# EAGLE design mrf49xa-small-v2 (EAGLE 5.11)
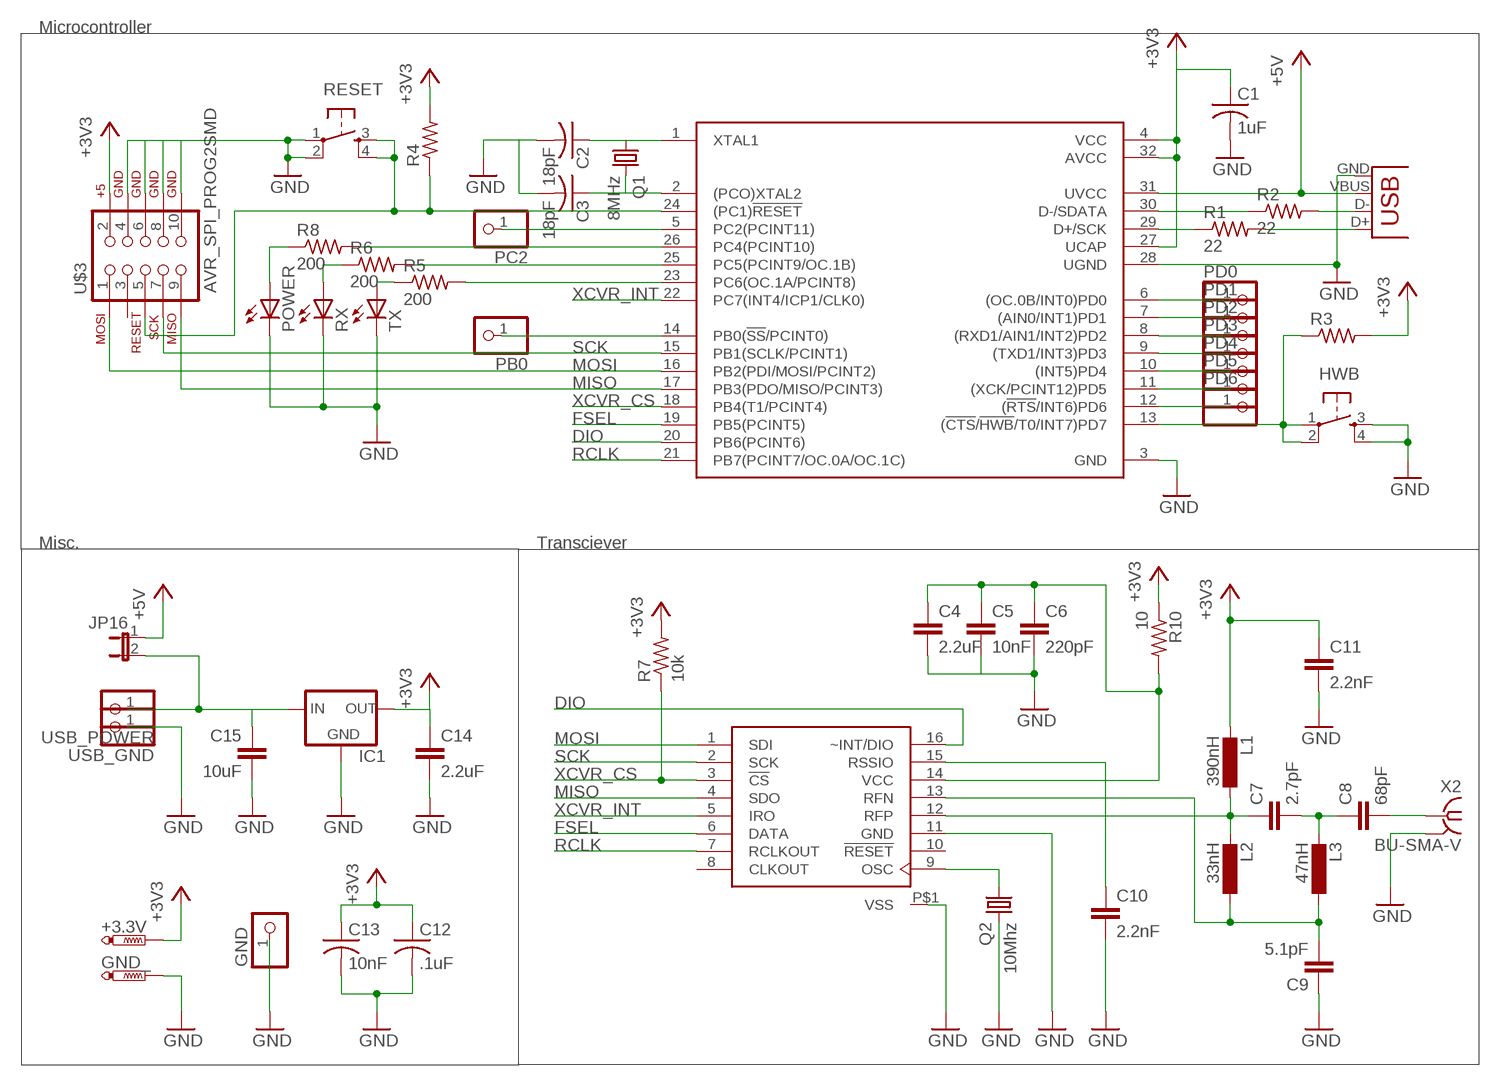
[diagram p0: schematic, sheet 1]

## Parts
+3.3V  PTR1PAD1-13  [P1-13]
C1  1uF  C-USC0603  [C0603]
C2  18pF  C-USC0603  [C0603]
C3  18pF  C-USC0603  [C0603]
C4  2.2uF  C-EUC3216  [C3216]
C5  10nF  C-EUC0603  [C0603]
C6  220pF  C-EUC0603  [C0603]
C7  2.7pF  C-EUC0603  [C0603]
C8  68pF  C-EUC0603  [C0603]
C9  5.1pF  C-EUC0603  [C0603]
C10  2.2nF  C-EUC0603  [C0603]
C11  2.2nF  C-EUC0603  [C0603]
C12  .1uF  C-USC0603  [C0603]
C13  10nF  C-USC0805  [C0805]
C14  2.2uF  C-EUC3216  [C3216]
C15  10uF  C-EUC3216  [C3216]
GND  PINHD-1X1  [1X01]
GND_  PTR1PAD1-13  [P1-13]
HWB  TAC_SWITCHSMD  [TACTILE_SWITCH_SMD]
IC1  78MXXLSOT-89  [SOT89-BCE]
JP16  JUMPER-2PTH  [1X02]
L1  390nH  L-EU0603  [R0603]
L2  33nH  L-EU0603  [R0603]
L3  47nH  L-EU0603  [R0603]
PB0  PINHD-1X1  [1X01]
PC2  PINHD-1X1  [1X01]
PD0  PINHD-1X1  [1X01]
PD1  PINHD-1X1  [1X01]
PD2  PINHD-1X1  [1X01]
PD3  PINHD-1X1  [1X01]
PD4  PINHD-1X1  [1X01]
PD5  PINHD-1X1  [1X01]
PD6  PINHD-1X1  [1X01]
POWER  LED1206  [LED-1206]
Q1  8MHz  CRYSTALCTS406  [CTS406]
Q2  10Mhz  CRYSTALCTS406  [CTS406]
R1  22  R-US_R0603  [R0603]
R2  22  R-US_R0603  [R0603]
R3  R-US_R0603  [R0603]
R4  R-US_R0603  [R0603]
R5  200  R-US_R0603  [R0603]
R6  200  R-US_R0603  [R0603]
R7  10k  R-US_R0603  [R0603]
R8  200  R-US_R0603  [R0603]
R10  10  R-US_R0603  [R0603]
RESET  TAC_SWITCHSMD  [TACTILE_SWITCH_SMD]
RX  LED1206  [LED-1206]
TX  LED1206  [LED-1206]
U$1  AT90USB2  [TQFP32-08]
U$2  MRF49XA  [TSSOP16]
U$3  AVR_SPI_PROG2SMD  [2X5-SHROUDED_SMD]
USB_GND  PINHD-1X1  [1X01]
USB_POWER  PINHD-1X1  [1X01]
X1  USBSMD  [USB-MINIB]
X2  BU-SMA-V  [BU-SMA-V]

## Nets
5V: C15.1 IC1.E(IN) JP16.2 USB_POWER.1
+3V3: +3.3V.TP C1.1 C11.1 C12.1 C13.1 C14.1 IC1.B(OUT) L1.2 R3.2 R4.2 R7.2 R10.1 U$1.4(VCC) U$1.27(UCAP) U$1.32(AVCC) U$3.2
+5V: JP16.1 U$1.31(UVCC) X1.VBUS
AMPCTRL: R6.2 U$1.25(PC5(PCINT9/OC.1B))
DIO: U$1.20(PB6(PCINT6)) U$2.16(~INT/DIO)
FSEL: U$1.19(PB5(PCINT5)) U$2.6(DATA)
GND: C1.2 C2.2 C3.2 C4.2 C5.2 C6.2 C9.1 C10.2 C11.2 C12.2 C13.2 C14.2 C15.2 GND.1 GND_.TP HWB.3 HWB.4 IC1.C(GND) POWER.C Q2.3 RESET.1 RESET.2 RX.C TX.C U$1.3(GND) U$1.28(UGND) U$2.11(GND) U$2.P$1(VSS) U$3.4 U$3.6 U$3.8 U$3.10 USB_GND.1 X1.GND X2.2(GND)
MISO: U$1.17(PB3(PDO/MISO/PCINT3)) U$2.4(SDO) U$3.9
MOSI: U$1.16(PB2(PDI/MOSI/PCINT2)) U$2.1(SDI) U$3.1
N$1: C8.2 X2.1
N$2: R1.1 U$1.29(D+/SCK)
N$3: R2.1 U$1.30(D-/SDATA)
N$4: R1.2 X1.D+
N$5: R2.2 X1.D-
N$6: R4.1 RESET.3 RESET.4 U$1.24((PC1)!RESET) U$3.5
N$7: C2.1 Q1.1 U$1.1(XTAL1)
N$8: C3.1 Q1.3 U$1.2((PCO)XTAL2)
N$9: PD3.1 U$1.9((TXD1/INT3)PD3)
N$10: R8.2 U$1.26(PC4(PCINT10))
N$11: R5.1 TX.A
N$12: R6.1 RX.A
N$13: POWER.A R8.1
N$14: PD2.1 U$1.8((RXD1/AIN1/INT2)PD2)
N$15: PB0.1 U$1.14(PB0(!SS!/PCINT0))
N$16: PD0.1 U$1.6((OC.0B/INT0)PD0)
N$17: HWB.1 HWB.2 R3.1 U$1.13((!CTS!/!HWB!/T0/INT7)PD7)
N$18: PD1.1 U$1.7((AIN0/INT1)PD1)
N$19: PD4.1 U$1.10((INT5)PD4)
N$20: Q2.1 U$2.9(OSC)
N$21: C9.2 L2.1 L3.1 U$2.13(RFN)
N$22: C7.1 L1.1 L2.2 U$2.12(RFP)
N$23: C7.2 C8.1 L3.2
N$25: C4.1 C5.1 C6.1 R10.2 U$2.14(VCC)
N$26: PD5.1 U$1.11((XCK/PCINT12)PD5)
N$27: PD6.1 U$1.12((!RTS!/INT6)PD6)
PC2: PC2.1 U$1.5(PC2(PCINT11))
RCLK: U$1.21(PB7(PCINT7/OC.0A/OC.1C)) U$2.7(RCLKOUT)
RSSIO: C10.1 U$2.15(RSSIO)
SCK: U$1.15(PB1(SCLK/PCINT1)) U$2.2(SCK) U$3.7
SWITCH1: R5.2 U$1.23(PC6(OC.1A/PCINT8))
XCVR_CS: R7.1 U$1.18(PB4(T1/PCINT4)) U$2.3(!CS)
XCVR_INT: U$1.22(PC7(INT4/ICP1/CLK0)) U$2.5(IRO)
Unconnected: U$2.8(CLKOUT) U$2.10(!RESET) U$3.3

## Notes on the sheet
- Microcontroller
- Misc. | Transciever

## Power pins joined to a net without a drawn wire
GND: X2.3(GND) X2.4(GND) X2.5(GND)

## Library data of the parts
+3.3V GND_ = testpad:PTR1: TEST PIN
C1-C3 C12 C13 = rcl:C-US: CAPACITOR, American symbol
C4-C11 C14 C15 = rcl:C-EU: CAPACITOR, European symbol
GND PB0 PC2 PD0 PD1-PD6 USB_GND USB_POWER = pinhead:PINHD-1X1: PIN HEADER
HWB RESET = SparkFun:TAC_SWITCH: Momentary Switch Button commonly used for reset or general input. Spark Fun Electronics SKU : COM-00097
IC1 = SLIM:78MXXL: VOLTAGE REGULATOR
JP16 = SparkFun:JUMPER-2: Jumper Basic 0.1" spaced jumper. Use with breakaway headers.
L1-L3 = rcl:L-EU: INDUCTOR, European symbol
POWER RX TX = SparkFun:LED: LEDs Standard schematic elements and footprints for 5mm, 3mm, 1206, and 0603 sized LEDs. 5mm - Spark Fun Electronics SKU : COM-00529 (and others)
Q1 Q2 = crystal:CRYSTAL: CRYSTAL
R1-R8 R10 = rcl:R-US_: RESISTOR, American symbol
U$1 = Atmel:AT90USB*2
U$2 = microchip:MRF49XA
U$3 = SparkFun:AVR_SPI_PROG2: AVR ICSP Header This is the standard AVR In Circuit Serial Programming header. Minimal, but includes pin one indicator. Works with standard Olimex programmers. Also look for the 6-pin reduced version. Spark Fun Electronics SKU: PRT-00778
X1 = SparkFun:USB: USB Connectors USB-B-PTH is fully proven SKU : PRT-00139 USB-miniB is fully proven SKU : PRT-00587 USB-A-PCB is untested. USB-A-H is throughly reviewed, but untested. Spark Fun Electronics SKU : PRT-00437 USB-B-SMT is throughly reviewed, but untested. Needs silkscreen touching up. USB-A-S has not been used/tested USB-MB-H has not been used/tested
X2 = con-coax:BU-SMA-V: FEMALE SMA CONNECTOR Radiall distributor RS 112-3794; OC_FARNELL: unknown; OC_NEWARK: unknown

## Board
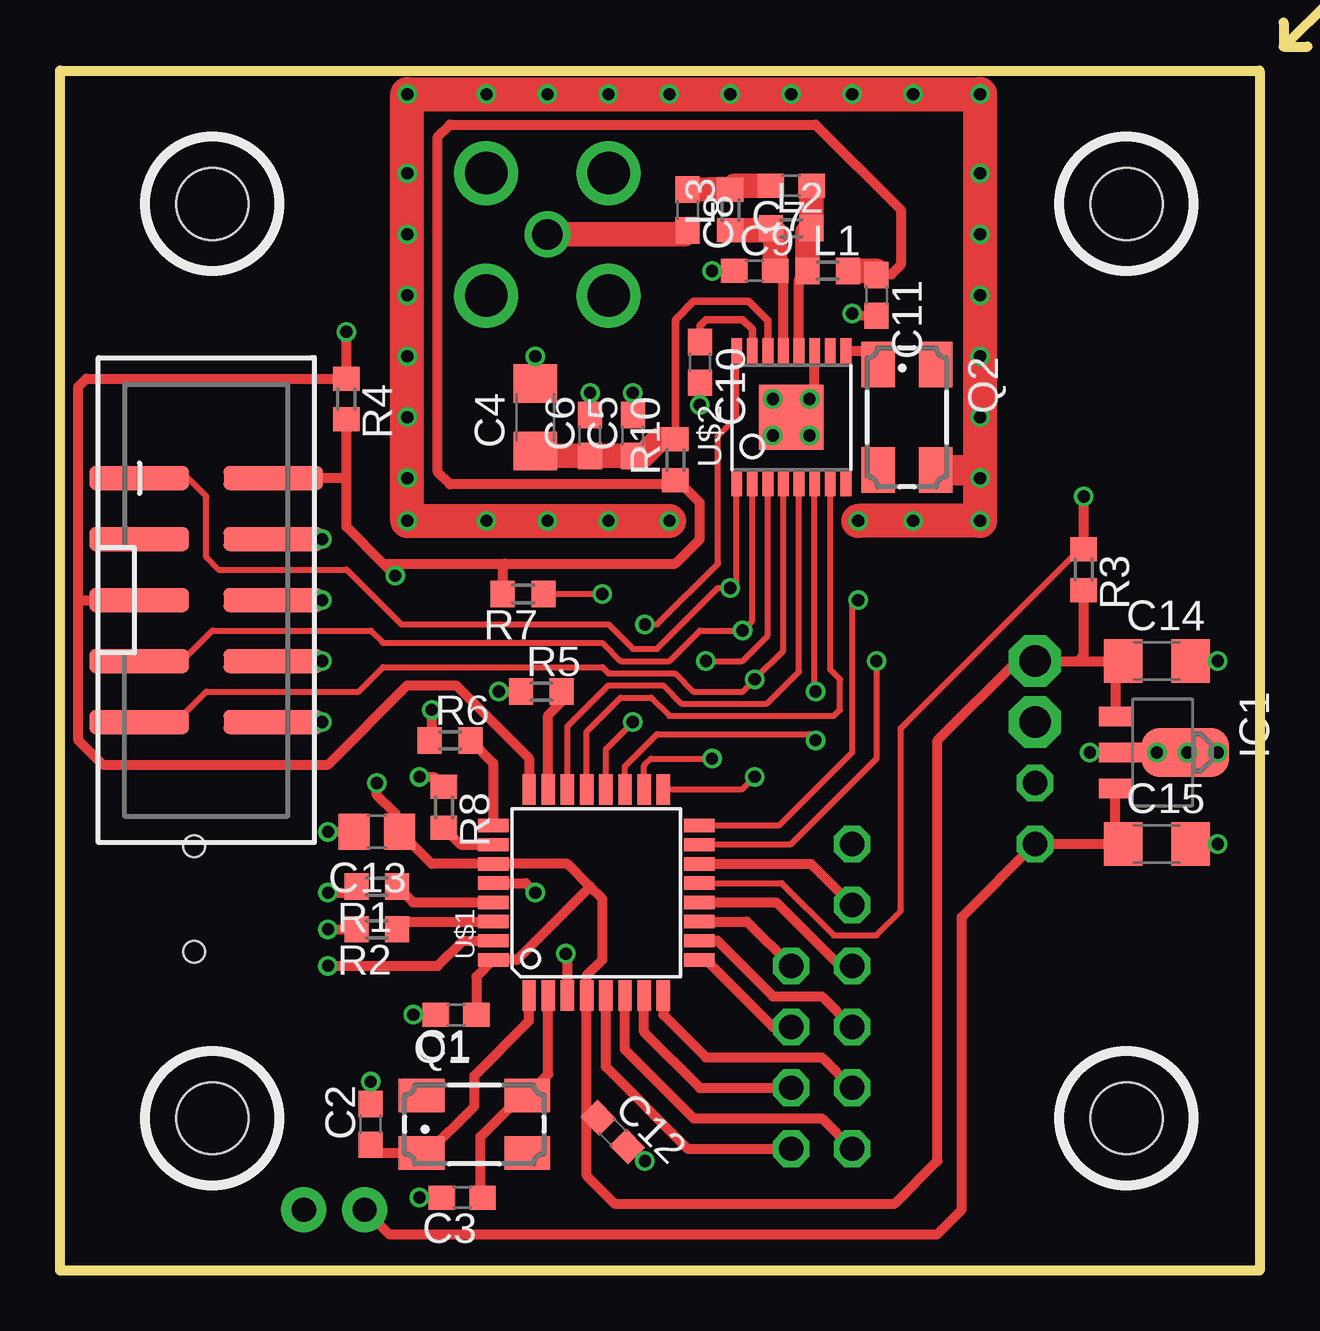
[diagram p1: board, top side]
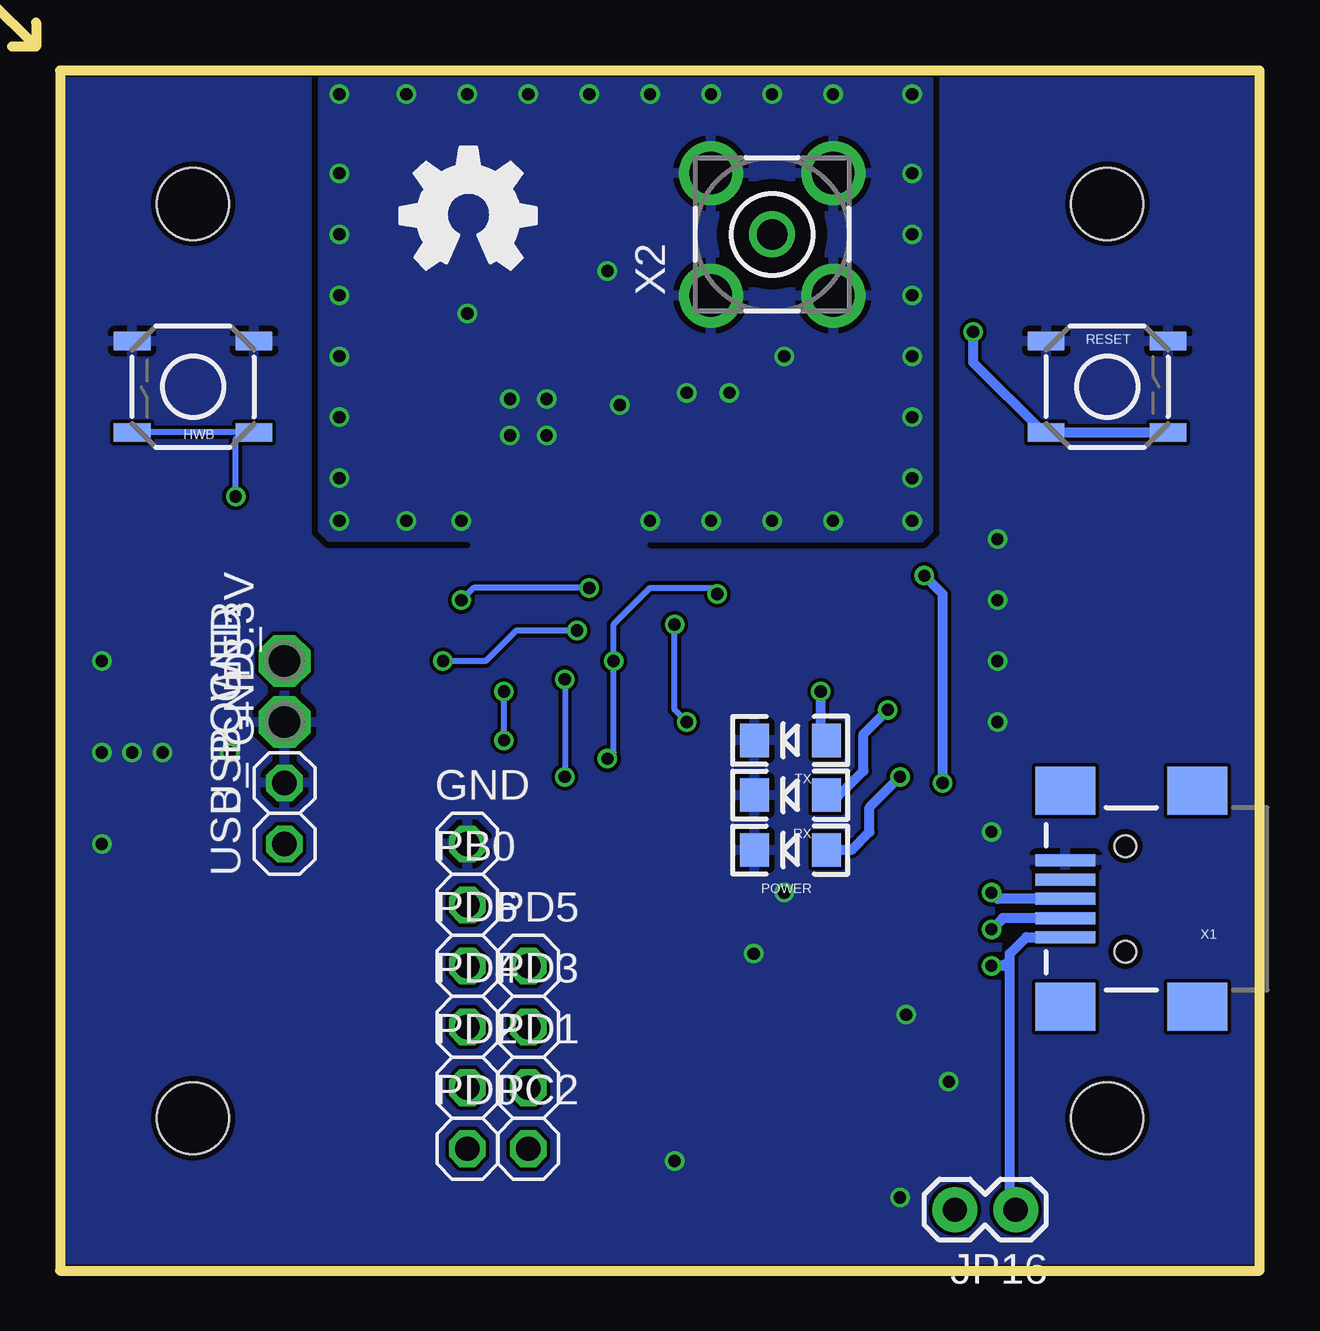
[diagram p2: board, bottom side, seen from below]

Size 50 x 50 mm. Coordinates in mm from the lower left corner, seen from the top.
Outline: 0,0 50,0 50,50 0,50 0,0
Copper layers (1*16): Top 0.035mm / dielectric 1.5mm / Bottom 0.035mm
Design rules "ITead_rule": minimum track width 6mil, minimum drill 12mil, track to track 6mil, track to pad 6mil, pad to pad 6mil, via to via 6mil, smd to smd 0mil, copper to edge 10mil, drill to drill 10mil, minimum pad ring 10mil, minimum via ring 6mil, stop-mask expansion 2mil, vias tented up to drill 100mil, thermal gap 10mil
Holes 3 mm at 6.35,44.45 44.45,44.45 44.45,6.35 6.35,6.35
bRestrict: area 18.5,41.4 to 22.1,45; 6 lines
Milling: 7 lines

### Footprints (pad centres in the part's own frame; a part is rotated, then mirrored left to right if it is on the bottom)
P1-13 = drill 1.321 pad 2.159 octagon: TP 0,0
C0603 = smd 1.1 x 1: 1 -0.85,0; 2 0.85,0
C3216 = smd 1.6 x 1.8: 1 -1.4,0; 2 1.4,0
C0805 = smd 1.3 x 1.5: 1 -0.95,0; 2 0.95,0
1X01 = drill 1.016 octagon: 1 0,0
TACTILE_SWITCH_SMD = smd 1.524 x 0.762: 1 -2.54,1.905; 2 2.54,1.905; 3 -2.54,-1.905; 4 2.54,-1.905
SOT89-BCE = smd 0.8 x 1.4: B -1.499,-1.981; E 1.499,-1.981 | smd 0.8 x 1.9: C 0,-1.727 | smd 2.032 x 3.65: C@1 0,0.94
1X02 = drill 1.016 pad 1.88 round: 1 0,0; 2 2.54,0
R0603 = smd 1 x 1.1: 1 -0.85,0; 2 0.85,0
LED-1206 = smd 1.2 x 1.4: A -1.5,0; C 1.5,0
CTS406 = smd 1.9 x 1.4: 1 -2.2,-1.2; 2 2.2,-1.2; 3 2.2,1.2; 4 -2.2,1.2
TQFP32-08 = smd 1.27 x 0.559: 1 -4.293,2.8; 2 -4.293,2; 3 -4.293,1.2; 4 -4.293,0.4; 5 -4.293,-0.4; 6 -4.293,-1.2; 7 -4.293,-2; 8 -4.293,-2.8; 17 4.293,-2.8; 18 4.293,-2; 19 4.293,-1.2; 20 4.293,-0.4; 21 4.293,0.4; 22 4.293,1.2; 23 4.293,2; 24 4.293,2.8 | smd 0.559 x 1.27: 9 -2.8,-4.293; 10 -2,-4.293; 11 -1.2,-4.293; 12 -0.4,-4.293; 13 0.4,-4.293; 14 1.2,-4.293; 15 2,-4.293; 16 2.8,-4.293; 25 2.8,4.293; 26 2,4.293; 27 1.2,4.293; 28 0.4,4.293; 29 -0.4,4.293; 30 -1.2,4.293; 31 -2,4.293; 32 -2.8,4.293
TSSOP16 = smd 0.45 x 1.05: 1 -2.275,-2.768; 2 -1.625,-2.768; 3 -0.975,-2.768; 4 -0.325,-2.768; 5 0.325,-2.768; 6 0.975,-2.768; 7 1.625,-2.768; 8 2.275,-2.768; 9 2.275,2.768; 10 1.625,2.768; 11 0.975,2.768; 12 0.325,2.768; 13 -0.325,2.768; 14 -0.975,2.768; 15 -1.625,2.768; 16 -2.275,2.768 | smd 2.7 x 2.7: P$1 0,0
2X5-SHROUDED_SMD = smd 4.15 x 1: 1 -2.794,5.08; 2 2.794,5.08; 3 -2.794,2.54; 4 2.794,2.54; 5 -2.794,0; 6 2.794,0; 7 -2.794,-2.54; 8 2.794,-2.54; 9 -2.794,-5.08; 10 2.794,-5.08
USB-MINIB = smd 2.5 x 0.5: D+ 2.5,0; D- 2.5,0.8; GND 2.5,-1.6; ID 2.5,-0.8; VBUS 2.5,1.6 | smd 2.5 x 2: GND@1 -3,-4.5; GND@2 -3,4.5; GND@3 2.5,4.5; GND@4 2.5,-4.5 | hole 0.9: 0,2.2; 0,-2.2
BU-SMA-V = drill 1.27 round: 1 0,0 | drill 1.778 round: 2 -2.55,2.55; 3 2.55,2.55; 4 2.55,-2.55; 5 -2.55,-2.55

### Placement (x,y rotation side)
+3.3V  40.64,25.4 90 bottom
C1  16.51,10.67 180 top
C2  12.95,6.1 90 top
C3  16.76,3.05 180 top
C4  19.81,35.56 90 top
C5  23.88,34.8 90 top
C6  22.1,34.8 90 top
C7  30.48,45.21 180 top
C8  26.16,44.2 270 top
C9  28.96,41.66 0 top
C10  26.67,37.85 270 top
C11  34.04,40.64 270 top
C12  23.04,5.77 315 top
C13  13.21,18.29 180 top
C14  45.72,25.4 0 top
C15  45.72,17.78 0 top
GND  33.02,17.78 0 bottom
GND_  40.64,22.86 90 bottom
HWB  44.45,36.83 180 bottom
IC1  45.97,21.59 270 top
JP16  10.16,2.54 180 bottom
L1  32,41.66 0 top
L2  30.48,43.43 0 top
L3  27.94,44.2 90 top
LOGO1  OSHW_LOGO_FILLX0200-NT  [OSHW_FILLX200_NOTEXT]  35.81,41.72 0 bottom
PB0  33.02,15.24 0 bottom
PC2  30.48,5.08 0 bottom
PD0  33.02,5.08 0 bottom
PD1  30.48,7.62 0 bottom
PD2  33.02,7.62 0 bottom
PD3  30.48,10.16 0 bottom
PD4  33.02,10.16 0 bottom
PD5  30.48,12.7 0 bottom
PD6  33.02,12.7 0 bottom
POWER  19.56,17.53 180 bottom
Q1  17.27,6.1 0 top
Q2  35.31,35.56 270 top
R1  13.21,16 180 top
R2  13.21,14.22 180 top
R3  42.67,29.21 270 top
R4  11.94,36.32 270 top
R5  20.07,24.13 0 top
R6  16.26,22.1 0 top
R7  19.3,28.19 180 top
R8  16,19.3 270 top
R10  25.65,33.78 90 top
RESET  6.35,36.83 0 bottom
RX  19.56,19.81 180 bottom
TX  19.56,22.1 180 bottom
U$1  22.35,15.75 90 top
U$2  30.48,35.56 0 top
U$3  6.1,27.94 0 top
USB_GND  40.64,20.32 90 bottom
USB_POWER  40.64,17.78 90 bottom
X1  5.59,15.49 180 bottom
X2  20.32,43.18 90 bottom

### Tracks (layer width: path | path; a pad name or v marks a point on that pad's centre or on a via)
5V
  Top 0.406: JP16.2 13.72,1.52 36.58,1.52 37.59,2.54 37.59,14.73 USB_POWER.1 C15.1 43.99,18.11 IC1.E
+3V3  (via drill 0.51)
  Top 0.254: 25.91,32.77 25.82,32.77 R10.1 | 18.54,29.46 18.45,29.38
  Top 0.406: C1.1 17.36,12.25 U$1.32 19.04,12.95 22.1,16 | 34.04,41.66 C11.1 34.66,41.52 35.05,41.91 35.05,44.2 31.5,47.75 16.26,47.75 15.75,47.24 15.75,33.27 16.26,32.77 25.91,32.77 26.67,32 26.67,30.48 25.65,29.46 18.54,29.46 13.46,29.46 | 11.94,33.02 U$3.2 | 11.94,33.02 11.94,30.99 13.46,29.46 | 11.94,33.02 R4.2 | 18.45,29.38 R7.2 | v13.97,28.96 13.46,29.46 | 22.1,16 22.61,15.49 22.61,12.95 21.95,12.3 U$1.4 21.95,6.35 | 22.1,16 21.15,16.95 U$1.27 15.5,16.95 C13.1 13.97,18.48 13.97,19.05 13.21,19.81 v13.21,20.32 | IC1.B 43.99,24.82 C14.1 42.42,25.4 | 42.42,25.4 +3.3V.TP 39.88,25.4 36.58,22.1 36.58,4.57 34.8,2.79 23.11,2.79 21.95,3.96 21.95,6.35 | R3.2 42.67,25.65 42.42,25.4 | C12.1 21.97,6.37 21.95,6.35
  Top 1.016: 34.04,41.66 L1.2
  Bottom 0.406: v13.21,20.32 13.21,28.19 v13.97,28.96
+5V  (via drill 0.51)
  Top 0.406: U$1.31 16.8,13.75 15.75,12.7 v11.18,12.7
  Bottom 0.406: X1.VBUS 9.73,13.89 10.41,13.21 10.41,12.95 | JP16.1 10.41,2.79 10.41,12.95 | v11.18,12.7 10.67,12.7 10.41,12.95
AMPCTRL
  Top 0.406: U$1.25 18.06,21.14 R6.2
DIO  (via drill 0.51)
  Top 0.254: U$1.20 22.75,21.74 v23.88,22.86 | v24.38,26.92 24.89,26.92 27.43,29.46 27.43,34.8 28.2,35.57 U$2.16
  Bottom 0.254: v23.88,22.86 24.38,23.37 v24.38,26.92
FSEL  (via drill 0.51)
  Top 0.254: U$2.6 31.45,24.34 v31.5,24.13 | U$1.19 23.55,21.01 24.89,22.35 31.24,22.35 v31.5,22.1
  Bottom 0.254: v31.5,22.1 v31.5,24.13
GND  (via drill 0.51)
  Top 0.406: v14.73,10.67 C1.2 | U$1.28 19.41,16.15 v19.81,15.75 | U$1.3 21.15,13.14 v21.08,13.21 | C2.2 v12.95,7.87 | v14.99,3.05 C3.2 | C12.2 24.15,4.81 v24.38,4.57 | C10.2 v26.67,36.07 | C5.2 v23.88,36.58 | U$2.11 31.45,36.53 v31.24,36.32 | v31.24,34.8 U$2.P$1 | C6.2 v22.1,36.58 | C4.2 v19.81,38.1 | v27.18,41.66 C9.1 | C13.2 v11.18,18.29 | C11.2 33.13,39.77 v33.02,39.88 | v42.93,21.59 IC1.C | U$3.4 v10.92,30.48 | U$3.6 v10.92,27.94 | U$3.8 v10.92,25.4 | U$3.10 v10.92,22.86 | C14.2 v48.26,25.4 | C15.2 v48.26,17.78
  Top 1.27: Q2.3 38.27,33.36 38.35,34.04
  Top 1.422: v33.27,31.24 v38.35,31.24 38.35,34.04 v38.35,49.02 v14.48,49.02 v14.48,31.24 v25.4,31.24
  other vias: 38.35,33.02 29.72,36.32 29.72,34.8 48.26,21.59 46.99,21.59 45.72,21.59 17.78,49.02 20.32,49.02 22.86,49.02 25.4,49.02 14.48,45.72 14.48,43.18 14.48,40.64 14.48,38.1 14.48,35.56 14.48,33.02 17.78,31.24 20.32,31.24 22.86,31.24 35.56,31.24 38.35,35.56 38.35,38.1 38.35,40.64 38.35,43.18 38.35,45.72 27.94,49.02 30.48,49.02 33.02,49.02 35.56,49.02
  pour Bottom: 0,50 50,50 50,0 0,0
MISO  (via drill 0.51)
  Top 0.254: U$2.4 30.16,25.84 v28.96,24.64 28.45,24.13 26.42,24.13 25.65,24.89 22.86,24.89 22.61,25.15 13.46,25.15 12.45,24.13 6.1,24.13 4.83,22.86 U$3.9 | U$1.17 28.42,20.04 v28.96,20.57
  Bottom 0.254: v28.96,24.64 v28.96,20.57
MOSI  (via drill 0.51)
  Top 0.254: v33.27,27.94 33.02,27.69 33.02,21.59 29.98,18.55 U$1.16 | U$2.1 28.2,28.71 v27.94,28.45 27.43,28.45 24.89,25.91 23.88,25.91 22.86,26.92 14.22,26.92 11.94,29.21 6.6,29.21 6.1,29.72 6.1,32.26 5.33,33.02 U$3.1
  Bottom 0.254: v27.94,28.45 32.77,28.45 v33.27,27.94
N$1
  Top 1.016: X2.1 26.02,43.18 C8.2
N$2
  Top 0.406: U$1.29 14.71,15.35 R1.1
N$3
  Top 0.406: U$1.30 14.38,14.55 R2.1
N$4  (via drill 0.51)
  Top 0.406: v11.18,15.75 12.1,15.75 R1.2
  Bottom 0.406: X1.D+ 10.92,15.49 v11.18,15.75
N$5  (via drill 0.51)
  Top 0.406: v11.18,14.22 R2.2
  Bottom 0.406: X1.D- 10.71,14.69 v11.18,14.22
N$6  (via drill 0.51)
  Top 0.406: 0.76,27.94 0.76,22.1 1.78,21.08 11.18,21.08 14.48,24.38 16.51,24.38 19.55,21.34 U$1.24 | 0.76,27.94 0.76,36.83 1.1,37.17 R4.1 v11.94,39.12 | 0.76,27.94 U$3.5
  Bottom 0.254: 9.02,34.92 RESET.3
  Bottom 0.406: RESET.3 RESET.4 | v11.94,39.12 11.94,37.85 9.02,34.92
N$7
  Top 0.406: U$1.1 19.55,10.41 17.27,8.13 17.27,6.86 15.31,4.9 Q1.1 13.3,4.9 C2.1
N$8
  Top 0.406: U$1.2 20.35,8.18 Q1.3 19.23,7.3 17.53,5.59 17.53,3.14 C3.1
N$9
  Top 0.406: PD3.1 29.72,10.16 26.93,12.95 U$1.9
N$10
  Top 0.406: U$1.26 16.71,17.75 R8.2
N$11  (via drill 0.51)
  Top 0.406: v18.29,24.13 R5.1
  Bottom 0.254: TX.A 18.03,22.12 18.29,22.35
  Bottom 0.406: 18.29,22.35 v18.29,24.13
N$12  (via drill 0.51)
  Top 0.254: 15.49,22.26 R6.1
  Top 0.406: v15.49,23.37 15.49,22.26
  Bottom 0.254: 17.53,19.81 RX.A
  Bottom 0.406: 17.53,19.81 16.51,20.83 16.51,22.35 v15.49,23.37
N$13  (via drill 0.51)
  Top 0.406: R8.1 15.58,20.57 v14.99,20.57
  Bottom 0.406: POWER.A 17.02,17.53 16.26,18.29 16.26,19.3 v14.99,20.57
N$14
  Top 0.406: U$1.8 25.15,10.66 26.92,8.89 31.75,8.89 PD2.1
N$15
  Top 0.406: U$1.14 31.31,16.95 PB0.1
N$16
  Top 0.406: U$1.6 23.55,9.21 26.42,6.35 31.75,6.35 PD0.1
N$17  (via drill 0.51)
  Top 0.254: U$1.13 30.08,16.15 32.26,13.97 34.04,13.97 35.05,14.99 35.05,22.61 42.51,30.06 R3.1
  Top 0.406: R3.1 v42.67,32.26
  Bottom 0.254: 42.42,34.92 HWB.1 | 42.42,34.92 HWB.2 | v42.67,32.26 42.67,34.67 42.42,34.92
N$18
  Top 0.406: U$1.7 24.35,9.94 26.67,7.62 PD1.1
N$19
  Top 0.406: U$1.10 27.4,13.75 29.72,11.43 31.75,11.43 PD4.1
N$20
  Top 0.406: U$2.9 33.54,38.33 Q2.1
N$21
  Top 0.406: U$2.13 30.16,41.33 C9.2 | 29.83,43.23 L2.1
  Top 1.016: C9.2 29.83,43.23 | L3.1 29.54,43.35 L2.1
N$22
  Top 0.406: U$2.12 30.8,41.31 L1.1 | 31.15,43.26 L2.2 | 31.33,45.19 C7.1
  Top 1.016: L1.1 31.15,43.26 | L2.2 31.33,45.19
N$23
  Top 1.016: C8.1 27.91,45.07 L3.2 28.11,45.21 C7.2
N$25
  Top 0.305: U$2.14 29.5,39.58 28.7,40.39 26.42,40.39 25.65,39.62 R10.2
  Top 1.016: C4.1 20.54,33.95 C6.1 C5.1 24.3,33.95 24.98,34.63 R10.2
N$26
  Top 0.406: U$1.11 28.63,14.55 PD5.1
N$27
  Top 0.406: PD6.1 32.51,12.7 29.86,15.35 U$1.12
PC2
  Top 0.406: U$1.5 22.75,8.49 26.16,5.08 PC2.1
RCLK
  Top 0.254: U$1.21 21.95,22.46 23.37,23.88 24.64,23.88 25.4,23.11 32.26,23.11 32.51,23.37 32.51,24.64 32.1,25.05 U$2.7
RSSIO
  Top 0.305: U$2.15 28.86,39.22 28.45,39.62 26.92,39.62 26.67,39.37 C10.1
SCK  (via drill 0.51)
  Top 0.254: U$2.2 28.86,27.08 v28.45,26.67 26.67,26.67 25.4,25.4 23.37,25.4 22.61,26.16 13.46,26.16 12.95,26.67 6.35,26.67 5.08,25.4 U$3.7 | U$1.15 30.45,17.75 34.04,21.34 v34.04,25.4
  Bottom 0.254: v28.45,26.67 30.99,26.67 32.26,25.4 v34.04,25.4
SWITCH1
  Top 0.406: U$1.23 20.35,23.15 20.92,23.71 R5.2
XCVR_CS  (via drill 0.51)
  Top 0.254: U$2.3 29.5,26.46 28.45,25.4 v26.92,25.4 | U$1.18 24.35,21.05 24.64,21.34 v27.18,21.34 | v22.61,28.19 R7.1
  Bottom 0.254: v27.18,21.34 26.92,21.59 v26.92,25.4 26.92,26.92 25.4,28.45 22.86,28.45 v22.61,28.19
XCVR_INT
  Top 0.254: U$1.22 21.15,22.68 22.86,24.38 25.15,24.38 25.91,23.62 29.46,23.62 30.8,24.96 U$2.5

### Text on the board
Milling: Board Outline
_tsilk: 68pF | 47nH | 2.7pF | 33nH | 390nH | 2.2nF | 5.1pF | 220pF | 2.2nF | AVR ISP | 10nF | 10Mhz | 10k | 2.2uF | 10 | MRF49XA | 10k | 10k | +3.3V | 2.2uF | 200 | 200 | GND | 7803 | 200 | GND | GND | USB V+ | 2.2uF | 22 | PB0 | 22 | PD5 | PD6 | PD4 | AT90USB2 | PD3 | 8 MHz | PD2 | PD1 | PD0 | PC2 | 12-22pF | 12-22pF
_bsilk: RF Out | USB to RF Transciever | 434 Mhz @ 17 dBm | Reset | (C) 2011 - William Dillon | Bootloader | http://alternet.us.com | +3.3V | GND | TX | GND | RX | USB Power | GND | Power | PB0 | PD6 | PD5 | PD4 | PD3 | PD2 | PD1 | PD0 | Use USB Power | PC2 | Licensed under the TAPR Open Hardware License | http://www.tapr.org/ohl